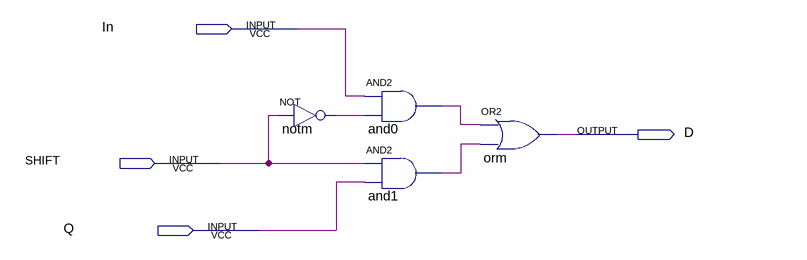
[diagram p0: schematic sheet]
// Quartus schematic MUX.bdf as structural Verilog: 4 symbols, 4 pins
module MUX (
  input  In,
  input  SHIFT,
  input  Q,
  output D
);

  wire and0_out, and1_out, notm_out;

  not notm (notm_out, SHIFT);
  and and0 (and0_out, In, notm_out);
  and and1 (and1_out, SHIFT, Q);
  or orm (D, and0_out, and1_out);
endmodule
